# Altium schematic sheet Neg12V.SchDoc
size A
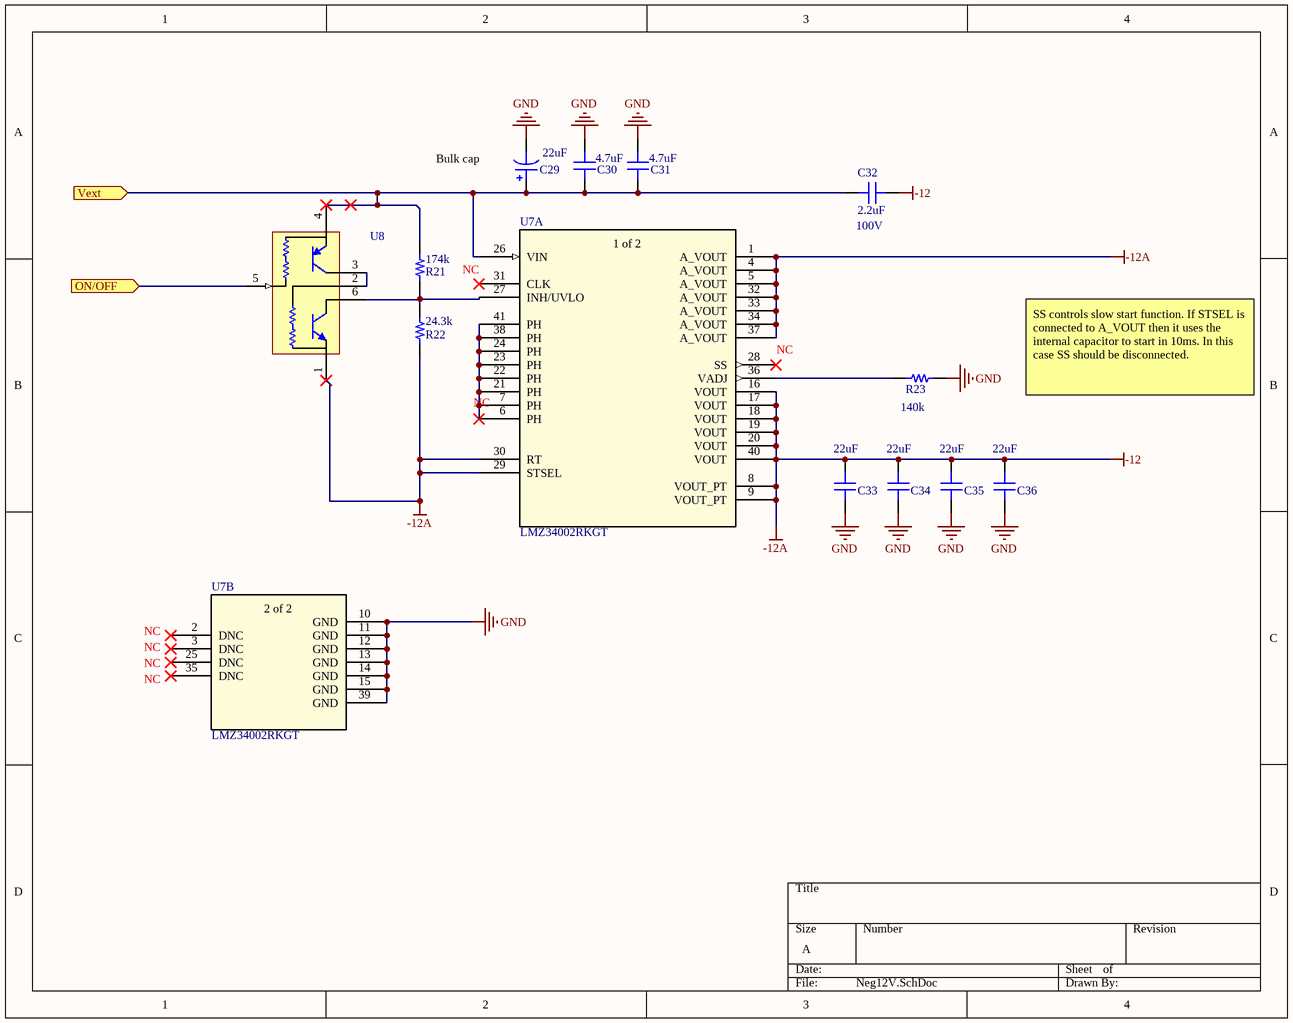
[diagram p0: Neg12V.SchDoc]

## Parts
C29  22uF  [CAP AL TH D8 L3.5 H11.5]
C30  4.7uF  [CAP 1206/3216 - 1.0MM]
C31  4.7uF  [CAP 1206/3216 - 1.0MM]
C32  2.2uF  [CAP 1206/3216]
C33  22uF  [CAP 1206/3216]
C34  22uF  [CAP 1206/3216]
C35  22uF  [CAP 1206/3216]
C36  22uF  [CAP 1206/3216]
R21  174k  [RES 0805/2012]
R22  24.3k  [RES 0805/2012]
R23  140k  [RES 0805/2012]
U7  LMZ34002RKGT  [RKG41]  (parts A,B of 2)
U8  DCX144EH-7  [SOT-563]  (value not drawn)

## Ports
ON/OFF (in), Vext (in)

## Nets
-12: C32.1 C33.2 C34.2 C35.2 C36.2 R22.1 U7.1(A_VOUT) U7.4(A_VOUT) U7.5(A_VOUT) U7.8(VOUT_PT) U7.9(VOUT_PT) U7.16(VOUT) U7.17(VOUT) U7.18(VOUT) U7.19(VOUT) U7.20(VOUT) U7.29(STSEL) U7.30(RT) U7.32(A_VOUT) U7.33(A_VOUT) U7.34(A_VOUT) U7.37(A_VOUT) U7.40(VOUT) U8.1  [also labelled -12A]
GND: C29.2 C30.2 C31.2 C33.1 C34.1 C35.1 C36.1 R23.2 U7.10(GND) U7.11(GND) U7.12(GND) U7.13(GND) U7.14(GND) U7.15(GND) U7.39(GND)
ON/OFF: U8.5 ; port ON/OFF
Vext: C29.1 C30.1 C31.1 C32.2 R21.2 U7.26(VIN) U8.4 ; port Vext
NetR21_1: R21.1 R22.2 U7.27(INH/UVLO) U8.6
NetR23_1: R23.1 U7.36(VADJ)
NetU7_6: U7.6(PH) U7.7(PH) U7.21(PH) U7.22(PH) U7.23(PH) U7.24(PH) U7.38(PH) U7.41(PH)
NetU8_2: U8.2 U8.3

Not connected (* = marked no-connect by the designer): U7 2(DNC)* 3(DNC)* 25(DNC)* 28(SS)* 31(CLK)* 35(DNC)*

## Notes on the sheet
- (near C29) Bulk cap
- (near C32) 100V
- NC
- (near U7) NC
- SS controls slow start function. If STSEL is connected to A_VOUT then it uses the internal capacitor to start in 10ms. In this case SS should be disconnected.
- (in symbol LMZ34002RKGT, part A) 1 of 2
- (in symbol LMZ34002RKGT, part B) 2 of 2

## Library data of the parts
C29 = EEU-FC2A220: CAP ALUM 22UF 20% 100V RADIAL; Manufacturer: Panasonic Electronic Components; TemperatureRange: -55°C ~ 105°C; Type: Automotive; Ripple Current: 169mA; Lifetime @ Temp: 2000 Hrs @ 105°C; Value: 22uF; Part Number: EEU-FC2A220; PartId: 7484; Supplier 1: Digi-Key; Supplier Part Number 1: P10770-ND; ComponentLink1Description: Datasheet; ComponentLink1URL: https://industrial.panasonic.com/ww/products/capacitors/aluminum-capacitors/aluminum-cap-lead/fc/EEUFC2A220; ComponentLink2Description: Digi-Key listing; ComponentLink2URL: https://www.digikey.com/product-detail/en/panasonic-electronic-components/EEU-FC2A220/P10770-ND/285722; Tolerance: 20%; Voltage: 100V; Price: 0.46; Device Package: Radial, Can - TH
C30 C31 = C3216X5R1H475K085AB: CAP CER 4.7UF 50V X5R 1206; Manufacturer: TDK Corporation; TemperatureRange: -55C ~ 85C; Tolerance: 10%; Value: 4.7uF; Part Number: C3216X5R1H475K085AB; PartId: 17022; Supplier 1: Digi-Key; Supplier Part Number 1: 445-14692-2-ND; ComponentLink1Description: Datasheet; ComponentLink1URL: https://product.tdk.com/info/en/catalog/datasheets/mlcc_commercial_general_en.pdf; ComponentLink2Description: Digi-Key Listing; ComponentLink2URL: https://www.digikey.com/product-detail/en/tdk-corporation/C3216X5R1H475K085AB/445-14692-2-ND/3951928; TemperatureCoefficient: X5R; Voltage: 50V; Price: 0.3159; Device Package: 1206 (3216 Metric)
C32 = CL31B225KCHSNNE: CAP CER 2.2UF 100V X7R 1206; Manufacturer: Samsung Electro-Mechanics America, Inc.; TemperatureRange: -55C ~ 125C; Tolerance: 10%; Value: 2.2uF; Part Number: CL31B225KCHSNNE; PartId: 6260; Supplier 1: Digi-Key; Supplier Part Number 1: 1276-3138-2-ND; ComponentLink1Description: Datasheet; ComponentLink1URL: http://media.digikey.com/pdf/Data%20Sheets/Samsung%20PDFs/CL31B225KCHSNNE_Spec.pdf; ComponentLink2Description: Digi-Key listing; ComponentLink2URL: http://digikey.com/product-detail/en/CL31B225KCHSNNE/1276-3138-2-ND/3888796; TemperatureCoefficient: X7R; Voltage: 100V; Price: 0.3227; Type: -; Device Package: 1206 (3216 Metric)
C33-C36 = CL31A226KAHNNNE: CAP CER 22UF 25V X5R 1206; Manufacturer: Samsung Electro-Mechanics America, Inc.; TemperatureRange: -55C ~ 85C; Tolerance: 10%; Value: 22uF; Part Number: CL31A226KAHNNNE; PartId: 15794; Supplier 1: Digi-Key; Supplier Part Number 1: 1276-3047-2-ND; ComponentLink1Description: Datasheet; ComponentLink1URL: //media.digikey.com/pdf/Data%20Sheets/Samsung%20PDFs/CL31A226KAHNNNE_Spec.pdf; ComponentLink2Description: Digi-Key Listing; ComponentLink2URL: https://www.digikey.com/product-detail/en/samsung-electro-mechanics-america-inc/CL31A226KAHNNNE/1276-3047-2-ND/3888705; TemperatureCoefficient: X5R; Voltage: 25V; Price: 0.1785; Device Package: 1206 (3216 Metric)
R21 = ERJ-6ENF1743V: RES SMD 174K OHM 1% 1/8W 0805; Manufacturer: Panasonic Electronic Components; TemperatureRange: -55C ~ 155C; TemperatureCoefficient: 100ppm/C; PowerRating: 0.125W, 1/8W; Value: 174k; Part Number: ERJ-6ENF1743V; PartId: 2344; Supplier 1: Digi-Key; Supplier Part Number 1: P174KCTR-ND; ComponentLink1Description: Datasheet; ComponentLink1URL: http://industrial.panasonic.com/www-cgi/jvcr13pz.cgi?E+PZ+3+AOA0002+ERJ6ENF1743V+7+WW; ComponentLink2Description: Digi-Key listing; ComponentLink2URL: http://digikey.com/product-detail/en/ERJ-6ENF1743V/P174KCTR-ND/111921; Tolerance: 1%; Price: 0.0073; Type: Thick Film; Device Package: 0805 (2012 Metric)
R22 = ERJ-6ENF2432V: RES SMD 24.3K OHM 1% 1/8W 0805; Manufacturer: Panasonic Electronic Components; TemperatureRange: -55C ~ 155C; TemperatureCoefficient: 100ppm/C; PowerRating: 0.125W, 1/8W; Value: 24.3k; Part Number: ERJ-6ENF2432V; PartId: 2331; Supplier 1: Digi-Key; Supplier Part Number 1: P24.3KCTR-ND; ComponentLink1Description: Datasheet; ComponentLink1URL: http://industrial.panasonic.com/www-cgi/jvcr13pz.cgi?E+PZ+3+AOA0002+ERJ6ENF2432V+7+WW; ComponentLink2Description: Digi-Key listing; ComponentLink2URL: http://digikey.com/product-detail/en/ERJ-6ENF2432V/P24.3KCTR-ND/111548; Tolerance: 1%; Price: 0.0073; Type: Thick Film; Device Package: 0805 (2012 Metric)
R23 = ERJ-6ENF1403V: RES SMD 140K OHM 1% 1/8W 0805; Manufacturer: Panasonic Electronic Components; TemperatureRange: -55C ~ 155C; TemperatureCoefficient: 100ppm/C; PowerRating: 0.125W, 1/8W; Value: 140k; Part Number: ERJ-6ENF1403V; PartId: 2209; Supplier 1: Digi-Key; Supplier Part Number 1: P140KCTR-ND; ComponentLink1Description: Datasheet; ComponentLink1URL: http://industrial.panasonic.com/www-cgi/jvcr13pz.cgi?E+PZ+3+AOA0002+ERJ6ENF1403V+7+WW; ComponentLink2Description: Digi-Key listing; ComponentLink2URL: http://digikey.com/product-detail/en/ERJ-6ENF1403V/P140KCTR-ND/111888; Tolerance: 1%; Price: 0.0073; Type: Thick Film; Device Package: 0805 (2012 Metric)
U7 = LMZ34002RKGT: No Description Available; Vendor: Texas Instruments; Built_By: EMA_UL_Team; Manufacturer_Part_Number: LMZ34002RKGT; Copyright: Copyright (C) 2018 Accelerated Designs. All rights reserved; RefDes: RefDes; Type: DEV; Value: Value
U8 = DCX144EH-7: TRANS PREBIAS NPN/PNP SOT563; Manufacturer: Diodes Incorporated; Power - Max: 150mW; Part Number: DCX144EH-7; PartId: 9696; Supplier 1: Digi-Key; Supplier Part Number 1: DCX144EH-7DICT-ND; ComponentLink1Description: Datasheet; ComponentLink1URL: https://www.diodes.com/assets/Datasheets/ds30422.pdf; ComponentLink2Description: Digi-Key Listing; ComponentLink2URL: https://www.digikey.com/product-detail/en/diodes-incorporated/DCX144EH-7/DCX144EH-7DICT-ND/5218295; Price: 0.42; Type: 1 NPN, 1 PNP - Pre-Biased (Dual); Device Package: SOT-563, SOT-666